# Altium project BeeWatch_Rev3.PrjPcb
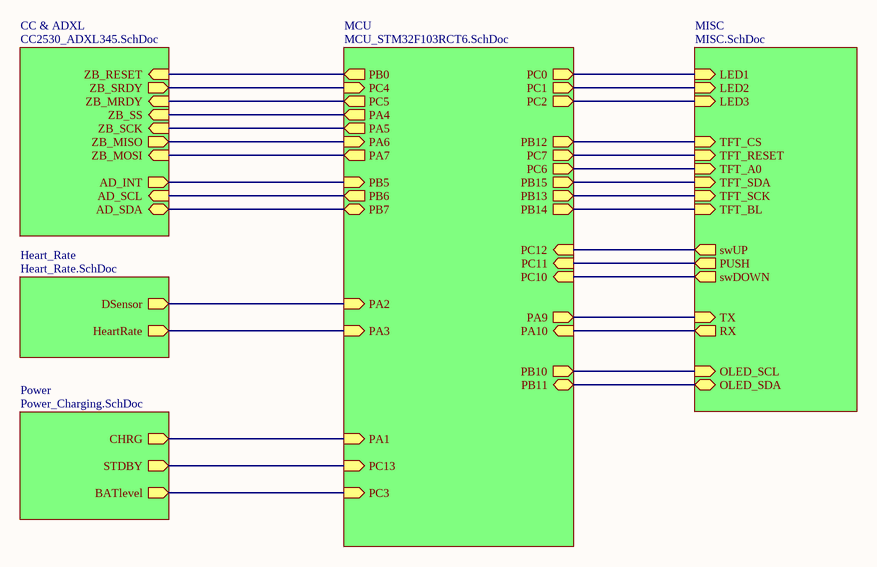
[diagram p0: BeeWatch_Rev3.SchDoc]
6 sheets, 88 parts. Net scope: hierarchical (ports join the sheet entries above them; power ports are global).
Board file: BeeWatch_Rev3.PcbDoc
Sheets:
  BeeWatch_Rev3.SchDoc
    MCU = MCU_STM32F103RCT6.SchDoc
    CC & ADXL = CC2530_ADXL345.SchDoc
    Heart_Rate = Heart_Rate.SchDoc
    Power = Power_Charging.SchDoc
    MISC = MISC.SchDoc

## Sheet BeeWatch_Rev3.SchDoc: BeeWatchRev3
size A; Revision: 1.0; SheetNumber: 6; SheetTotal: 6

### Sub-sheets
CC & ADXL = CC2530_ADXL345.SchDoc: ZB_RESET (in), ZB_MRDY (in), ZB_SRDY (out), ZB_SS (in), ZB_SCK (in), ZB_MISO (out), ZB_MOSI (in), AD_INT (out), AD_SCL (in), AD_SDA (bidir)
Heart_Rate = Heart_Rate.SchDoc: DSensor (out), HeartRate (out)
MCU = MCU_STM32F103RCT6.SchDoc: PB0 (out), PC4 (in), PC5 (out), PA4 (out), PA5 (out), PA6 (in), PA7 (out), PB5 (in), PB6 (out), PB7 (bidir), PA2 (in), PA3 (in), PC3 (in), PC13 (in), PA1 (in), PC0 (out), PC1 (out), PC2 (out), PB12 (out), PC6 (out), PC7 (out), PB15 (out), PB13 (out), PB14 (out), PC12 (in), PC11 (in), PC10 (in), PA9 (out), PA10 (in), PB10 (out), PB11 (bidir)
MISC = MISC.SchDoc: LED1 (in), LED2 (in), LED3 (in), TFT_CS (in), TFT_RESET (in), TFT_A0 (in), TFT_SDA (in), TFT_SCK (in), TFT_BL (in), swUP (out), PUSH (out), swDOWN (out), TX (in), RX (out), OLED_SCL (in), OLED_SDA (bidir)
Power = Power_Charging.SchDoc: CHRG (out), STDBY (out), BATlevel (out)

### Nets
AD_INT: sheet MCU/PB5, sheet CC & ADXL/AD_INT
AD_SCL: sheet MCU/PB6, sheet CC & ADXL/AD_SCL
AD_SDA: sheet MCU/PB7, sheet CC & ADXL/AD_SDA
BATlevel: sheet MCU/PC3, sheet Power/BATlevel
CHRG: sheet MCU/PA1, sheet Power/CHRG
DSensor: sheet MCU/PA2, sheet Heart_Rate/DSensor
OLED_SCL: sheet MCU/PB10, sheet MISC/OLED_SCL
OLED_SDA: sheet MCU/PB11, sheet MISC/OLED_SDA
PA3: sheet MCU/PA3, sheet Heart_Rate/HeartRate
PA4: sheet MCU/PA4, sheet CC & ADXL/ZB_SS
PA5: sheet MCU/PA5, sheet CC & ADXL/ZB_SCK
PA6: sheet MCU/PA6, sheet CC & ADXL/ZB_MISO
PA7: sheet MCU/PA7, sheet CC & ADXL/ZB_MOSI
PA9: sheet MCU/PA9, sheet MISC/TX
PA10: sheet MCU/PA10, sheet MISC/RX
PB0: sheet MCU/PB0, sheet CC & ADXL/ZB_RESET
PB12: sheet MCU/PB12, sheet MISC/TFT_CS
PB13: sheet MCU/PB13, sheet MISC/TFT_SCK
PB14: sheet MCU/PB14, sheet MISC/TFT_BL
PB15: sheet MCU/PB15, sheet MISC/TFT_SDA
PC0: sheet MCU/PC0, sheet MISC/LED1
PC1: sheet MCU/PC1, sheet MISC/LED2
PC2: sheet MCU/PC2, sheet MISC/LED3
PC4: sheet MCU/PC4, sheet CC & ADXL/ZB_SRDY
PC5: sheet MCU/PC5, sheet CC & ADXL/ZB_MRDY
PC6: sheet MCU/PC6, sheet MISC/TFT_A0
PC7: sheet MCU/PC7, sheet MISC/TFT_RESET
PC10: sheet MCU/PC10, sheet MISC/swDOWN
PC11: sheet MCU/PC11, sheet MISC/PUSH
PC12: sheet MCU/PC12, sheet MISC/swUP
PC13: sheet MCU/PC13, sheet Power/STDBY

### Notes on the sheet
- Title
- Size:
- Date:
- A
- Number:
- Time:
- Revision:
- Sheet
- of
- File:

## Sheet MCU_STM32F103RCT6.SchDoc: MCU_STM32F103RC
size A; Revision: 1.3; SheetNumber: 1; SheetTotal: 6; ProjectName: BeeWatch
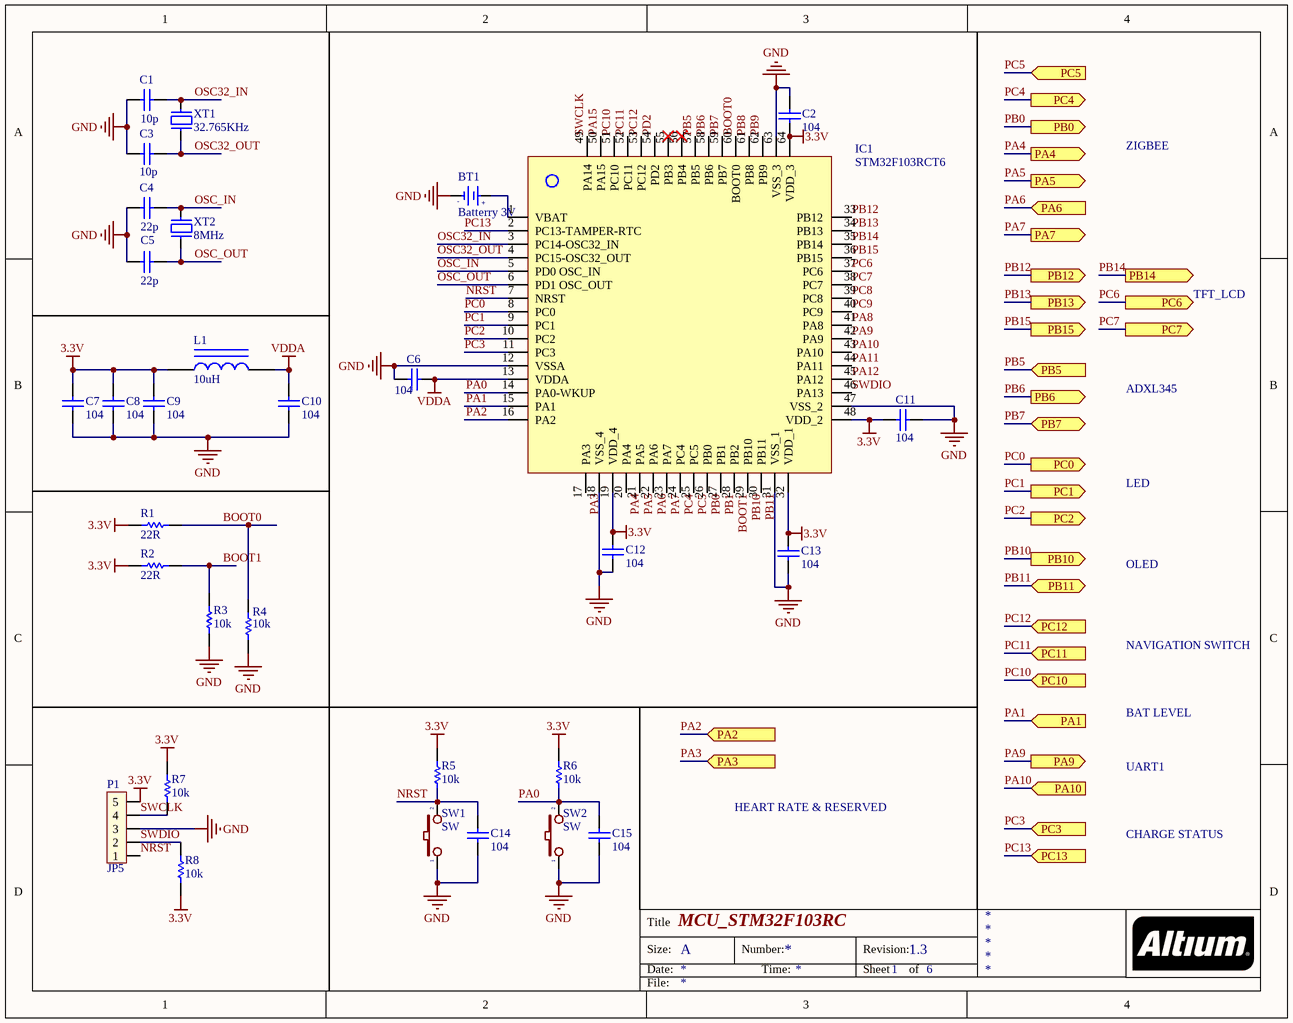
[diagram p1: MCU_STM32F103RCT6.SchDoc]

### Parts
BT1  Batterry 3V  [Battery3V_SMD]
C1  10p  [Cap 0805]
C2  104  [Cap 0805]
C3  10p  [Cap 0805]
C4  22p  [Cap 0805]
C5  22p  [Cap 0805]
C6  104  [Cap 0805]
C7  104  [Cap 0805]
C8  104  [Cap 0805]
C9  104  [Cap 0805]
C10  104  [Cap 0805]
C11  104  [Cap 0805]
C12  104  [Cap 0805]
C13  104  [Cap 0805]
C14  104  [Cap 0805]
C15  104  [Cap 0805]
IC1  STM32F103RCT6  [stm32f103rct6]
L1  10uH  [Inductor 0805]
P1  JP5  [JP5]
R1  22R  [RES 0805]
R2  22R  [RES 0805]
R3  10k  [RES 0805]
R4  10k  [RES 0805]
R5  10k  [RES 0805]
R6  10k  [RES 0805]
R7  10k  [RES 0805]
R8  10k  [RES 0805]
SW1  SW  [sw_ran_2pin]
SW2  SW  [sw_ran_2pin]
XT1  32.765KHz  [XTAL_32K]
XT2  8MHz  [XTAL_6035]

### Ports
PA1 (in), PA2 (in), PA3 (in), PA4 (out), PA5 (out), PA6 (in), PA7 (out), PA9 (out), PA10 (in), PB0 (out), PB5 (in), PB6 (out), PB7, PB10 (out), PB11 (bidir), PB12 (out), PB13 (out), PB14 (out), PB15 (out), PC0 (out), PC1 (out), PC2 (out), PC3 (in), PC4 (out), PC5 (in), PC6 (out), PC7 (out), PC10 (in), PC11 (in), PC12 (in), PC13 (in)

### Nets
3.3V: C2.2 C7.2 C8.2 C9.2 C11.2 C12.2 C13.2 IC1.19(VDD_4) IC1.32(VDD_1) IC1.48(VDD_2) IC1.64(VDD_3) L1.1 P1.5 R1.2 R2.2 R5.2 R6.2 R7.2 R8.1
GND: BT1.2(GND) C1.2 C2.1 C3.2 C4.2 C5.2 C6.2 C7.1 C8.1 C9.1 C10.1 C11.1 C12.1 C13.1 C14.1 C15.1 IC1.12(VSSA) IC1.18(VSS_4) IC1.31(VSS_1) IC1.47(VSS_2) IC1.63(VSS_3) P1.3 R3.1 R4.1 SW1.1 SW2.1
VDDA: C6.1 C10.2 IC1.13(VDDA) L1.2
BOOT0: IC1.60(BOOT0) R1.1 R4.2
BOOT1: IC1.28(PB2) R2.1 R3.2
NRST: C14.2 IC1.7(NRST) P1.1 R5.1 SW1.2
OSC32_IN: C1.1 IC1.3(PC14-OSC32_IN) XT1.2
OSC32_OUT: C3.1 IC1.4(PC15-OSC32_OUT) XT1.1
OSC_IN: C4.1 IC1.5(PD0_OSC_IN) XT2.2
OSC_OUT: C5.1 IC1.6(PD1_OSC_OUT) XT2.1
PA0: C15.2 IC1.14(PA0-WKUP) R6.1 SW2.2
PA1: IC1.15(PA1) ; port PA1  [project net CHRG]
PA2: IC1.16(PA2) ; port PA2  [project net DSensor]
PA3: IC1.17(PA3) ; port PA3
PA4: IC1.20(PA4) ; port PA4
PA5: IC1.21(PA5) ; port PA5
PA6: IC1.22(PA6) ; port PA6
PA7: IC1.23(PA7) ; port PA7
PA8: IC1.41(PA8)
PA9: IC1.42(PA9) ; port PA9
PA10: IC1.43(PA10) ; port PA10
PA11: IC1.44(PA11)
PA12: IC1.45(PA12)
PA15: IC1.50(PA15)
PB0: IC1.26(PB0) ; port PB0
PB1: IC1.27(PB1)
PB5: IC1.57(PB5) ; port PB5  [project net AD_INT]
PB6: IC1.58(PB6) ; port PB6  [project net AD_SCL]
PB7: IC1.59(PB7) ; port PB7  [project net AD_SDA]
PB8: IC1.61(PB8)
PB9: IC1.62(PB9)
PB10: IC1.29(PB10) ; port PB10  [project net OLED_SCL]
PB11: IC1.30(PB11) ; port PB11  [project net OLED_SDA]
PB12: IC1.33(PB12) ; port PB12
PB13: IC1.34(PB13) ; port PB13
PB14: IC1.35(PB14) ; port PB14
PB15: IC1.36(PB15) ; port PB15
PC0: IC1.8(PC0) ; port PC0
PC1: IC1.9(PC1) ; port PC1
PC2: IC1.10(PC2) ; port PC2
PC3: IC1.11(PC3) ; port PC3  [project net BATlevel]
PC4: IC1.24(PC4) ; port PC4
PC5: IC1.25(PC5) ; port PC5
PC6: IC1.37(PC6) ; port PC6
PC7: IC1.38(PC7) ; port PC7
PC8: IC1.39(PC8)
PC9: IC1.40(PC9)
PC10: IC1.51(PC10) ; port PC10
PC11: IC1.52(PC11) ; port PC11
PC12: IC1.53(PC12) ; port PC12
PC13: IC1.2(PC13-TAMPER-RTC) ; port PC13
PD2: IC1.54(PD2)
SWCLK: IC1.49(PA14) P1.4 R7.1
SWDIO: IC1.46(PA13) P1.2 R8.2
NetBT1_1: BT1.1(+3V) IC1.1(VBAT)

Not connected (* = marked no-connect by the designer): IC1 55(PB3)* 56(PB4)*

### Notes on the sheet
- ZIGBEE
- TFT_LCD
- ADXL345
- LED
- OLED
- NAVIGATION SWITCH
- BAT LEVEL
- UART1
- HEART RATE & RESERVED
- CHARGE STATUS
- Title
- Size:
- Date:
- A
- Number:
- Time:
- Revision:
- Sheet
- of
- File:
- (in symbol Battery3V) -; +

### Library data of the parts
BT1 = Battery3V
C1-C15 = Cap_0805
L1 = inductor_0805: inductor 0805
R1-R8 = Res_0805: resistor smd0805
SW1 SW2 = SW2: Switch button 2 pin; Value: SW chip 2 pin
XT1 XT2 = Xtal

## Sheet CC2530_ADXL345.SchDoc: CC2530_ADXL345
size A; Revision: 1.0; SheetNumber: 4; SheetTotal: 6
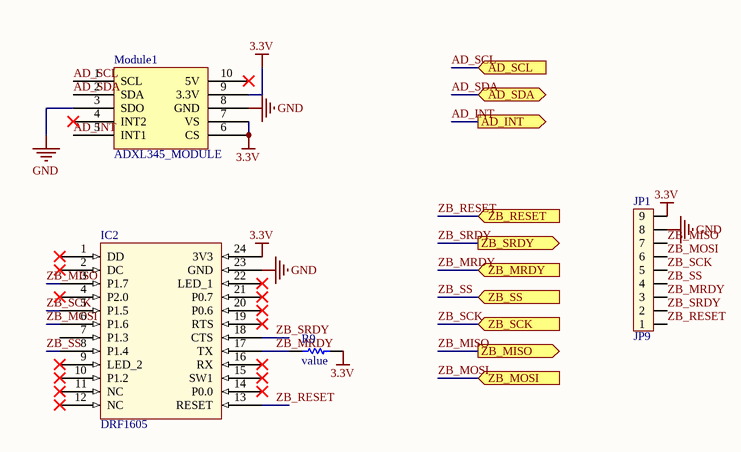
[diagram p2: CC2530_ADXL345.SchDoc]

### Parts
IC2  DRF1605  [DRF1605]
JP1  JP9  [JP9]
Module1  ADXL345_MODULE  [ADXL345_MODULE]
R9  value  [RES 0805]

### Ports
AD_INT (out), AD_SCL (in), AD_SDA (bidir), ZB_MISO (out), ZB_MOSI (in), ZB_MRDY (in), ZB_RESET (in), ZB_SCK (in), ZB_SRDY (out), ZB_SS (in)

### Nets
3.3V: IC2.24(3V3) JP1.9 Module1.6(CS) Module1.7(VS) Module1.9(3.3V) R9.1
GND: IC2.23(GND) JP1.8 Module1.3(SDO) Module1.8(GND)
AD_INT: Module1.5(INT1) ; port AD_INT
AD_SCL: Module1.1(SCL) ; port AD_SCL
AD_SDA: Module1.2(SDA) ; port AD_SDA
ZB_MISO: IC2.3(P1.7) JP1.7 ; port ZB_MISO  [project net PA6]
ZB_MOSI: IC2.6(P1.6) JP1.6 ; port ZB_MOSI  [project net PA7]
ZB_MRDY: IC2.17(TX) JP1.3 R9.2 ; port ZB_MRDY  [project net PC5]
ZB_RESET: IC2.13(RESET) JP1.1 ; port ZB_RESET  [project net PB0]
ZB_SCK: IC2.5(P1.5) JP1.5 ; port ZB_SCK  [project net PA5]
ZB_SRDY: IC2.18(CTS) JP1.2 ; port ZB_SRDY  [project net PC4]
ZB_SS: IC2.8(P1.4) JP1.4 ; port ZB_SS  [project net PA4]

Not connected (* = marked no-connect by the designer): IC2 1(DD)* 2(DC)* 4(P2.0)* 7(P1.3) 9(LED_2)* 10(P1.2)* 11(NC)* 12(NC)* 14(P0.0)* 15(SW1)* 16(RX)* 19(RTS)* 20(P0.6)* 21(P0.7)* 22(LED_1)*; Module1 4(INT2)* 10(5V)*

### Notes on the sheet
- Title
- Size:
- Date:
- A
- Number:
- Time:
- Revision:
- Sheet
- of
- File:

### Library data of the parts
R9 = Res_0805: resistor smd0805

## Sheet Heart_Rate.SchDoc: Heart Rate
size A; Revision: 1.0; SheetNumber: 2; SheetTotal: 6
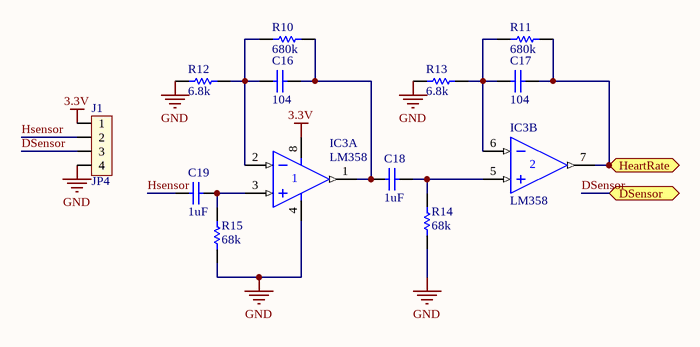
[diagram p3: Heart_Rate.SchDoc]

### Parts
C16  104  [Cap 0805]
C17  104  [Cap 0805]
C18  1uF  [Cap 0805]
C19  1uF  [Cap 0805]
IC3  LM358  [SOP-8]  (parts A,B of 2)
J1  JP4  [JP_CAI_4]
R10  680k  [RES 0805]
R11  680k  [RES 0805]
R12  6.8k  [RES 0805]
R13  6.8k  [RES 0805]
R14  68k  [RES 0805]
R15  68k  [RES 0805]

### Ports
DSensor, HeartRate

### Nets
3.3V: IC3.8(V+) J1.1
GND: IC3.4(V-) J1.4 R12.2 R13.2 R14.1 R15.1
DSensor: J1.3 ; port DSensor
Hsensor: C19.2 J1.2
PA3: C17.1 IC3.7(OUT) R11.1 ; port HeartRate
NetC16_1: C16.1 C18.2 IC3.1(OUT) R10.1
NetC16_2: C16.2 IC3.2(IN-) R10.2 R12.1
NetC17_2: C17.2 IC3.6(IN-) R11.2 R13.1
NetC18_1: C18.1 IC3.5(IN+) R14.2
NetC19_1: C19.1 IC3.3(IN+) R15.2

### Notes on the sheet
- Title
- Size:
- Date:
- A
- Number:
- Time:
- Revision:
- Sheet
- of
- File:

### Library data of the parts
C16-C19 = Cap_0805
IC3 = LM358_SMD: LM358_OPAMP
R10-R15 = Res_0805: resistor smd0805

## Sheet Power_Charging.SchDoc: Power
size A; Revision: 1.0; SheetNumber: 3; SheetTotal: 6
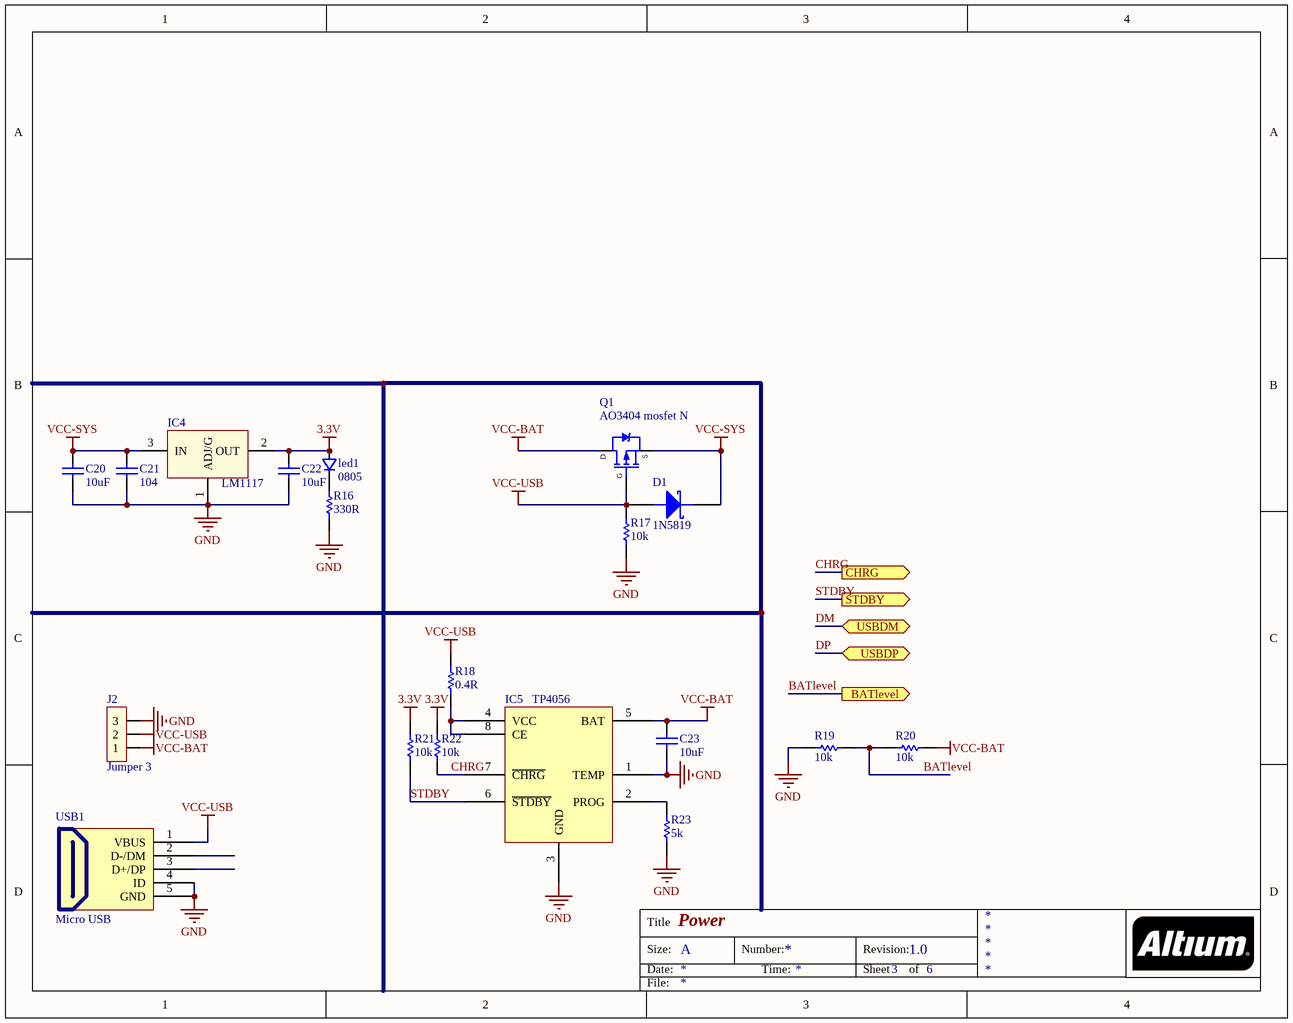
[diagram p4: Power_Charging.SchDoc]

### Parts
C20  10uF  [Cap 0805]
C21  104  [Cap 0805]
C22  10uF  [Cap 0805]
C23  10uF  [Cap 0805]
D1  1N5819  [1N5819_SMD]
IC4  LM1117  [SOT223-4N]
IC5  TP4056  [SOP-8]
J2  Jumper 3  [jp3]
led1  0805  [0805]
Q1  AO3404 mosfet N  [SOT23-3]
R16  330R  [RES 0805]
R17  10k  [RES 0805]
R18  0.4R  [RES_2512]
R19  10k  [RES 0805]
R20  10k  [RES 0805]
R21  10k  [RES 0805]
R22  10k  [RES 0805]
R23  5k  [RES 0805]
USB1  Micro USB  [Micro USB]

### Ports
BATlevel (out), CHRG (out), STDBY (out), USBDM, USBDP

### Nets
3.3V: C22.2 IC4.2(OUT) led1.1 R21.2 R22.2
GND: C20.1 C21.1 C22.1 C23.1 IC4.1(ADJ/G) IC5.1(TEMP) IC5.3(GND) J2.3 R16.2 R17.1 R19.2 R23.1 USB1.4(ID) USB1.5(GND)
VCC-BAT: C23.2 IC5.5(BAT) J2.1 Q1.3(D) R20.1
VCC-SYS: C20.2 C21.2 D1.2(K) IC4.3(IN) Q1.2(S)
VCC-USB: D1.1(A) J2.2 Q1.1(G) R17.2 R18.2 USB1.1(VBUS)
BATlevel: R19.1 R20.2 ; port BATlevel
CHRG: IC5.7(~{CHRG}) R22.1 ; port CHRG
DM: port USBDM
DP: port USBDP
STDBY: IC5.6(~{STDBY}) R21.1 ; port STDBY  [project net PC13]
NetIC5_2: IC5.2(PROG) R23.2
NetIC5_4: IC5.4(VCC) IC5.8(CE) R18.1
Netled1_2: led1.2 R16.1

Not connected (* = marked no-connect by the designer): USB1 2(D-/DM) 3(D+/DP)

### Notes on the sheet
- Title
- Size:
- Date:
- A
- Number:
- Time:
- Revision:
- Sheet
- of
- File:

### Library data of the parts
C20-C23 = Cap_0805
D1 = SS14_1N5819_SMD: 1N5819 diode schottky
IC4 = LM1117: Available in 1.8V, 2.5V, 2.85V, 3.3V, 5V, and  Adjustable Versions; Value: LM317
IC5 = TP4056: Lithium Batterry charger IC
J2 = JP3: Value: J3
led1 = led_dan
Q1 = AO3405_mosfet: AO3404 mosfet N sot23-3
R16 R17 R19-R23 = Res_0805: resistor smd0805
R18 = res_2512
USB1 = MicroUSB

## Sheet MISC.SchDoc: MISC
size A; Revision: 1.0; SheetNumber: 5; SheetTotal: 6
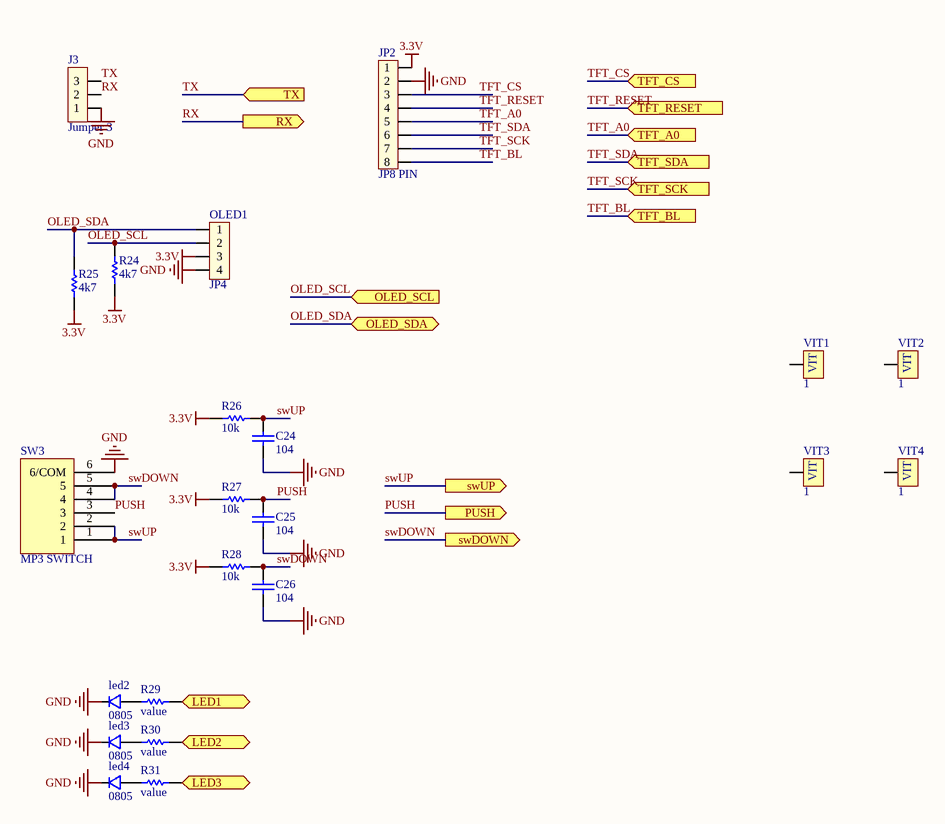
[diagram p5: MISC.SchDoc]

### Parts
C24  104  [Cap 0805]
C25  104  [Cap 0805]
C26  104  [Cap 0805]
J3  Jumper 3  [jp3]
JP2  JP8 PIN  [JP_CAI_8]
led2  0805  [0805]
led3  0805  [0805]
led4  0805  [0805]
OLED1  JP4  [JP_CAI_4]
R24  4k7  [RES 0805]
R25  4k7  [RES 0805]
R26  10k  [RES 0805]
R27  10k  [RES 0805]
R28  10k  [RES 0805]
R29  value  [RES 0805]
R30  value  [RES 0805]
R31  value  [RES 0805]
SW3  MP3 SWITCH  [mp3switch]
VIT1  1  [VIT]
VIT2  1  [VIT]
VIT3  1  [VIT]
VIT4  1  [VIT]

### Ports
LED1 (in), LED2 (in), LED3 (in), OLED_SCL (in), OLED_SDA, PUSH (out), RX (out), swDOWN (out), swUP (out), TFT_A0 (in), TFT_BL (in), TFT_CS (in), TFT_RESET (in), TFT_SCK (in), TFT_SDA (in), TX (in)

### Nets
3.3V: JP2.1 OLED1.3 R24.2 R25.2 R26.2 R27.2 R28.2
GND: C24.1 C25.1 C26.1 J3.1 JP2.2 led2.2 led3.2 led4.2 OLED1.4 SW3.6(6/COM)
OLED_SCL: OLED1.2 R24.1 ; port OLED_SCL
OLED_SDA: OLED1.1 R25.1 ; port OLED_SDA
PC0: R29.1 ; port LED1
PC1: R30.1 ; port LED2
PC2: R31.1 ; port LED3
PUSH: C25.2 R27.1 SW3.3 ; port PUSH  [project net PC11]
RX: J3.2 ; port RX  [project net PA10]
swDOWN: C26.2 R28.1 SW3.4 SW3.5 ; port swDOWN  [project net PC10]
swUP: C24.2 R26.1 SW3.1 SW3.2 ; port swUP  [project net PC12]
TFT_A0: JP2.5 ; port TFT_A0  [project net PC6]
TFT_BL: JP2.8 ; port TFT_BL  [project net PB14]
TFT_CS: JP2.3 ; port TFT_CS  [project net PB12]
TFT_RESET: JP2.4 ; port TFT_RESET  [project net PC7]
TFT_SCK: JP2.7 ; port TFT_SCK  [project net PB13]
TFT_SDA: JP2.6 ; port TFT_SDA  [project net PB15]
TX: J3.3 ; port TX  [project net PA9]
Netled2_1: led2.1 R29.2
Netled3_1: led3.1 R30.2
Netled4_1: led4.1 R31.2

Not connected (* = marked no-connect by the designer): VIT1 VIT1(1); VIT2 VIT1(1); VIT3 VIT1(1); VIT4 VIT1(1)

### Notes on the sheet
- Title
- Size:
- Date:
- A
- Number:
- Time:
- Revision:
- Sheet
- of
- File:

### Library data of the parts
C24-C26 = Cap_0805
J3 = JP3: Value: J3
JP2 = JP8: Value: JP7
led2-led4 = led_dan
R24-R31 = Res_0805: resistor smd0805
SW3 = mp3Switch: mp3 navigation switch
VIT1-VIT4 = VIT: Oc Vit

## Nets that join several sheets
3.3V: MCU_STM32F103RCT6 (19 pins), CC2530_ADXL345 (6 pins), Heart_Rate (IC3.8 J1.1), Power_Charging (5 pins), MISC (7 pins)
GND: MCU_STM32F103RCT6 (26 pins), CC2530_ADXL345 (IC2.23 JP1.8 Module1.3 Module1.8), Heart_Rate (6 pins), Power_Charging (14 pins), MISC (10 pins)
AD_INT: MCU_STM32F103RCT6 (IC1.57), CC2530_ADXL345 (Module1.5)
AD_SCL: MCU_STM32F103RCT6 (IC1.58), CC2530_ADXL345 (Module1.1)
AD_SDA: MCU_STM32F103RCT6 (IC1.59), CC2530_ADXL345 (Module1.2)
BATlevel: MCU_STM32F103RCT6 (IC1.11), Power_Charging (R19.1 R20.2)
CHRG: MCU_STM32F103RCT6 (IC1.15), Power_Charging (IC5.7 R22.1)
DSensor: MCU_STM32F103RCT6 (IC1.16), Heart_Rate (J1.3)
OLED_SCL: MCU_STM32F103RCT6 (IC1.29), MISC (OLED1.2 R24.1)
OLED_SDA: MCU_STM32F103RCT6 (IC1.30), MISC (OLED1.1 R25.1)
PA3: MCU_STM32F103RCT6 (IC1.17), Heart_Rate (C17.1 IC3.7 R11.1)
PA4: MCU_STM32F103RCT6 (IC1.20), CC2530_ADXL345 (IC2.8 JP1.4)
PA5: MCU_STM32F103RCT6 (IC1.21), CC2530_ADXL345 (IC2.5 JP1.5)
PA6: MCU_STM32F103RCT6 (IC1.22), CC2530_ADXL345 (IC2.3 JP1.7)
PA7: MCU_STM32F103RCT6 (IC1.23), CC2530_ADXL345 (IC2.6 JP1.6)
PA9: MCU_STM32F103RCT6 (IC1.42), MISC (J3.3)
PA10: MCU_STM32F103RCT6 (IC1.43), MISC (J3.2)
PB0: MCU_STM32F103RCT6 (IC1.26), CC2530_ADXL345 (IC2.13 JP1.1)
PB12: MCU_STM32F103RCT6 (IC1.33), MISC (JP2.3)
PB13: MCU_STM32F103RCT6 (IC1.34), MISC (JP2.7)
PB14: MCU_STM32F103RCT6 (IC1.35), MISC (JP2.8)
PB15: MCU_STM32F103RCT6 (IC1.36), MISC (JP2.6)
PC0: MCU_STM32F103RCT6 (IC1.8), MISC (R29.1)
PC1: MCU_STM32F103RCT6 (IC1.9), MISC (R30.1)
PC2: MCU_STM32F103RCT6 (IC1.10), MISC (R31.1)
PC4: MCU_STM32F103RCT6 (IC1.24), CC2530_ADXL345 (IC2.18 JP1.2)
PC5: MCU_STM32F103RCT6 (IC1.25), CC2530_ADXL345 (IC2.17 JP1.3 R9.2)
PC6: MCU_STM32F103RCT6 (IC1.37), MISC (JP2.5)
PC7: MCU_STM32F103RCT6 (IC1.38), MISC (JP2.4)
PC10: MCU_STM32F103RCT6 (IC1.51), MISC (C26.2 R28.1 SW3.4 SW3.5)
PC11: MCU_STM32F103RCT6 (IC1.52), MISC (C25.2 R27.1 SW3.3)
PC12: MCU_STM32F103RCT6 (IC1.53), MISC (C24.2 R26.1 SW3.1 SW3.2)
PC13: MCU_STM32F103RCT6 (IC1.2), Power_Charging (IC5.6 R21.1)